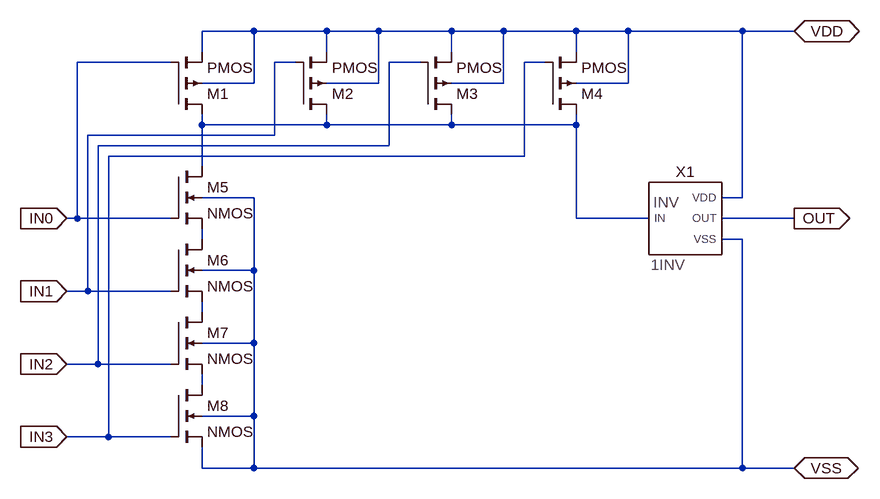
[diagram p0: schematic 4AND.asc]
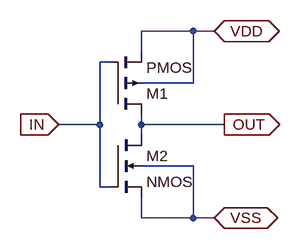
[diagram p1: sub-circuit 1inv.asc]
4AND.asc, the LTspice schematic file:
Version 4
SHEET 1 880 680
WIRE -96 -224 -176 -224
WIRE 16 -224 -96 -224
WIRE 96 -224 16 -224
WIRE 208 -224 96 -224
WIRE 288 -224 208 -224
WIRE 400 -224 288 -224
WIRE 480 -224 400 -224
WIRE 656 -224 480 -224
WIRE 736 -224 656 -224
WIRE -176 -192 -176 -224
WIRE 16 -192 16 -224
WIRE 208 -192 208 -224
WIRE 400 -192 400 -224
WIRE -224 -176 -368 -176
WIRE -32 -176 -64 -176
WIRE 160 -176 112 -176
WIRE 352 -176 320 -176
WIRE -96 -144 -96 -224
WIRE -96 -144 -176 -144
WIRE 96 -144 96 -224
WIRE 96 -144 16 -144
WIRE 288 -144 288 -224
WIRE 288 -144 208 -144
WIRE 480 -144 480 -224
WIRE 480 -144 400 -144
WIRE -176 -80 -176 -96
WIRE 16 -80 16 -96
WIRE 16 -80 -176 -80
WIRE 208 -80 208 -96
WIRE 208 -80 16 -80
WIRE 400 -80 400 -96
WIRE 400 -80 208 -80
WIRE -64 -64 -64 -176
WIRE -64 -64 -352 -64
WIRE 112 -48 112 -176
WIRE 112 -48 -336 -48
WIRE 320 -32 320 -176
WIRE 320 -32 -320 -32
WIRE -176 -16 -176 -80
WIRE -96 32 -176 32
WIRE 656 32 656 -224
WIRE 656 32 624 32
WIRE -368 64 -368 -176
WIRE -368 64 -384 64
WIRE -224 64 -368 64
WIRE 400 64 400 -80
WIRE 512 64 400 64
WIRE 736 64 624 64
WIRE -176 96 -176 80
WIRE 656 96 624 96
WIRE -96 144 -96 32
WIRE -96 144 -176 144
WIRE -352 176 -352 -64
WIRE -352 176 -384 176
WIRE -224 176 -352 176
WIRE -176 208 -176 192
WIRE -96 256 -96 144
WIRE -96 256 -176 256
WIRE -336 288 -336 -48
WIRE -336 288 -384 288
WIRE -224 288 -336 288
WIRE -176 320 -176 304
WIRE -96 368 -96 256
WIRE -96 368 -176 368
WIRE -320 400 -320 -32
WIRE -320 400 -384 400
WIRE -224 400 -320 400
WIRE -176 448 -176 416
WIRE -96 448 -96 368
WIRE -96 448 -176 448
WIRE 656 448 656 96
WIRE 656 448 -96 448
WIRE 736 448 656 448
FLAG 736 64 OUT
IOPIN 736 64 Out
FLAG 736 -224 VDD
IOPIN 736 -224 BiDir
FLAG 736 448 VSS
IOPIN 736 448 BiDir
FLAG -384 64 IN0
IOPIN -384 64 In
FLAG -384 176 IN1
IOPIN -384 176 In
FLAG -384 288 IN2
IOPIN -384 288 In
FLAG -384 400 IN3
IOPIN -384 400 In
SYMBOL nmos4 -224 96 R0
SYMATTR InstName M6
SYMATTR Value2 l=110n w=180n
SYMBOL nmos4 -224 -16 R0
SYMATTR InstName M5
SYMATTR Value2 l=110n w=180n
SYMBOL pmos4 -224 -96 M180
SYMATTR InstName M1
SYMATTR Value2 l=110n w=180n
SYMBOL pmos4 352 -96 M180
SYMATTR InstName M4
SYMATTR Value2 l=110n w=180n
SYMBOL 1INV 560 64 R0
SYMATTR InstName X1
SYMBOL nmos4 -224 208 R0
SYMATTR InstName M7
SYMATTR Value2 l=110n w=180n
SYMBOL nmos4 -224 320 R0
SYMATTR InstName M8
SYMATTR Value2 l=110n w=180n
SYMBOL pmos4 -32 -96 M180
SYMATTR InstName M2
SYMATTR Value2 l=110n w=180n
SYMBOL pmos4 160 -96 M180
SYMATTR InstName M3
SYMATTR Value2 l=110n w=180n

1inv.asc, the sub-circuit schematic file:
Version 4
SHEET 1 880 680
WIRE 224 -16 144 -16
WIRE 256 -16 224 -16
WIRE 144 16 144 -16
WIRE 96 32 80 32
WIRE 224 64 224 -16
WIRE 224 64 144 64
WIRE 80 128 80 32
WIRE 80 128 16 128
WIRE 144 128 144 112
WIRE 272 128 144 128
WIRE 144 144 144 128
WIRE 224 192 144 192
WIRE 80 224 80 128
WIRE 96 224 80 224
WIRE 144 272 144 240
WIRE 224 272 224 192
WIRE 224 272 144 272
WIRE 256 272 224 272
FLAG 16 128 IN
IOPIN 16 128 In
FLAG 272 128 OUT
IOPIN 272 128 Out
FLAG 256 -16 VDD
IOPIN 256 -16 BiDir
FLAG 256 272 VSS
IOPIN 256 272 BiDir
SYMBOL pmos4 96 112 M180
SYMATTR InstName M1
SYMATTR Value2 l=110nM w=180nM
SYMBOL nmos4 96 144 R0
SYMATTR InstName M2
SYMATTR Value2 l=110nM w=180nM

The netlist it stands for:
* 4AND.asc
M6 N002 IN1 N003 VSS NMOS l=110n w=180n
M5 N001 IN0 N002 VSS NMOS l=110n w=180n
M1 N001 IN0 VDD VDD PMOS l=110n w=180n
M4 N001 IN3 VDD VDD PMOS l=110n w=180n
XX1 N001 OUT VDD VSS 1inv
M7 N003 IN2 N004 VSS NMOS l=110n w=180n
M8 N004 IN3 VSS VSS NMOS l=110n w=180n
M2 N001 IN1 VDD VDD PMOS l=110n w=180n
M3 N001 IN2 VDD VDD PMOS l=110n w=180n

* block symbol definitions
.subckt 1inv IN OUT VDD VSS
M1 OUT IN VDD VDD PMOS l=110nM w=180nM
M2 OUT IN VSS VSS NMOS l=110nM w=180nM
.ends 1inv

.model NMOS NMOS
.model PMOS PMOS
.lib standard.mos
.backanno
.end